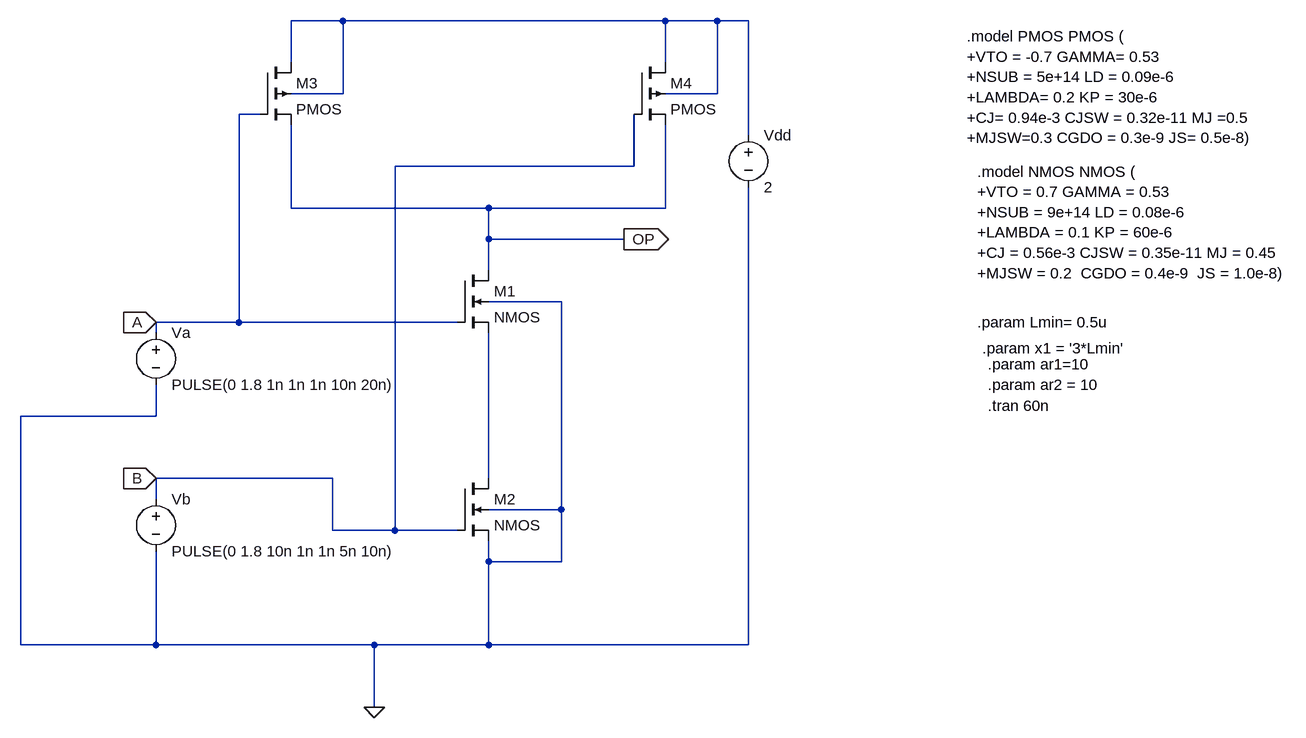
[diagram p0: schematic NAND.asc]
NAND.asc, the LTspice schematic file:
Version 4
SHEET 1 1508 836
WIRE -16 -240 -96 -240
WIRE 480 -240 -16 -240
WIRE 560 -240 480 -240
WIRE 608 -240 560 -240
WIRE -96 -176 -96 -240
WIRE 480 -176 480 -240
WIRE -16 -128 -16 -240
WIRE -16 -128 -96 -128
WIRE 560 -128 560 -240
WIRE 560 -128 480 -128
WIRE -144 -96 -176 -96
WIRE 608 -64 608 -240
WIRE 432 -16 432 -96
WIRE 432 -16 64 -16
WIRE -96 48 -96 -80
WIRE 208 48 -96 48
WIRE 480 48 480 -80
WIRE 480 48 208 48
WIRE 208 96 208 48
WIRE 416 96 208 96
WIRE 208 144 208 96
WIRE 320 192 208 192
WIRE -176 224 -176 -96
WIRE -176 224 -304 224
WIRE 160 224 -176 224
WIRE -304 240 -304 224
WIRE -304 368 -304 320
WIRE -304 368 -512 368
WIRE -32 464 -304 464
WIRE 208 464 208 240
WIRE -304 496 -304 464
WIRE 320 512 320 192
WIRE 320 512 208 512
WIRE -32 544 -32 464
WIRE 64 544 64 -16
WIRE 64 544 -32 544
WIRE 160 544 64 544
WIRE 208 592 208 560
WIRE 320 592 320 512
WIRE 320 592 208 592
WIRE -512 720 -512 368
WIRE -304 720 -304 576
WIRE -304 720 -512 720
WIRE 32 720 -304 720
WIRE 208 720 208 592
WIRE 208 720 32 720
WIRE 608 720 608 16
WIRE 608 720 208 720
WIRE 32 816 32 720
FLAG 416 96 OP
IOPIN 416 96 Out
FLAG -304 224 A
IOPIN -304 224 In
FLAG -304 464 B
IOPIN -304 464 In
FLAG 32 816 0
SYMBOL nmos4 160 144 R0
SYMATTR InstName M1
SYMATTR Value2 l={Lmin} w={AR1*Lmin} ad={x1*AR1*Lmin} as={x1*AR1*Lmin} pd={2*x1 + 2*AR1*Lmin} ps={2*x1 + 2*AR1*Lmin}
SYMBOL nmos4 160 464 R0
SYMATTR InstName M2
SYMATTR Value2 l={Lmin} w={AR1*Lmin} ad={x1*AR1*Lmin} as={x1*AR1*Lmin} pd={2*x1 + 2*AR1*Lmin} ps={2*x1 + 2*AR1*Lmin}
SYMBOL voltage -304 224 R0
WINDOW 123 0 0 Left 0
WINDOW 39 0 0 Left 0
SYMATTR InstName Va
SYMATTR Value PULSE(0 1.8 1n 1n 1n 10n 20n)
SYMBOL voltage -304 480 R0
WINDOW 123 0 0 Left 0
WINDOW 39 0 0 Left 0
SYMATTR InstName Vb
SYMATTR Value PULSE(0 1.8 10n 1n 1n 5n 10n)
SYMBOL pmos4 -144 -176 R0
SYMATTR InstName M3
SYMATTR Value2 l={Lmin} w={AR2*Lmin} ad={x1*AR2*Lmin} as={x1*AR2*Lmin} pd={2*x1 + 2*AR2*Lmin} ps={2*x1 + 2*AR2*Lmin}
SYMBOL pmos4 432 -176 R0
SYMATTR InstName M4
SYMATTR Value2 l={Lmin} w={AR2*Lmin} ad={x1*AR2*Lmin} as={x1*AR2*Lmin} pd={2*x1 + 2*AR2*Lmin} ps={2*x1 + 2*AR2*Lmin}
SYMBOL voltage 608 -80 R0
WINDOW 123 0 0 Left 0
WINDOW 39 0 0 Left 0
SYMATTR InstName Vdd
SYMATTR Value 2
TEXT 944 -216 Left 2 !.model PMOS PMOS (\n+VTO = -0.7 GAMMA= 0.53 \n+NSUB = 5e+14 LD = 0.09e-6 \n+LAMBDA= 0.2 KP = 30e-6\n+CJ= 0.94e-3 CJSW = 0.32e-11 MJ =0.5 \n+MJSW=0.3 CGDO = 0.3e-9 JS= 0.5e-8)
TEXT 960 -8 Left 2 !.model NMOS NMOS ( \n+VTO = 0.7 GAMMA = 0.53 \n+NSUB = 9e+14 LD = 0.08e-6 \n+LAMBDA = 0.1 KP = 60e-6 \n+CJ = 0.56e-3 CJSW = 0.35e-11 MJ = 0.45 \n+MJSW = 0.2  CGDO = 0.4e-9  JS = 1.0e-8)
TEXT 960 224 Left 2 !.param Lmin= 0.5u
TEXT 968 264 Left 2 !.param x1 = '3*Lmin'
TEXT 976 288 Left 2 !.param ar1=10
TEXT 976 320 Left 2 !.param ar2 = 10
TEXT 976 352 Left 2 !.tran 60n

The netlist it stands for:
* NAND.asc
M1 OP A N002 0 NMOS l={Lmin} w={AR1*Lmin} ad={x1*AR1*Lmin} as={x1*AR1*Lmin} pd={2*x1 + 2*AR1*Lmin} ps={2*x1 + 2*AR1*Lmin}
M2 N002 B 0 0 NMOS l={Lmin} w={AR1*Lmin} ad={x1*AR1*Lmin} as={x1*AR1*Lmin} pd={2*x1 + 2*AR1*Lmin} ps={2*x1 + 2*AR1*Lmin}
Va A 0 PULSE(0 1.8 1n 1n 1n 10n 20n)
Vb B 0 PULSE(0 1.8 10n 1n 1n 5n 10n)
M3 N001 A OP N001 PMOS l={Lmin} w={AR2*Lmin} ad={x1*AR2*Lmin} as={x1*AR2*Lmin} pd={2*x1 + 2*AR2*Lmin} ps={2*x1 + 2*AR2*Lmin}
M4 N001 B OP N001 PMOS l={Lmin} w={AR2*Lmin} ad={x1*AR2*Lmin} as={x1*AR2*Lmin} pd={2*x1 + 2*AR2*Lmin} ps={2*x1 + 2*AR2*Lmin}
Vdd N001 0 2
.model NMOS NMOS
.model PMOS PMOS
.lib standard.mos
.model PMOS PMOS (
+VTO = -0.7 GAMMA= 0.53
+NSUB = 5e+14 LD = 0.09e-6
+LAMBDA= 0.2 KP = 30e-6
+CJ= 0.94e-3 CJSW = 0.32e-11 MJ =0.5
+MJSW=0.3 CGDO = 0.3e-9 JS= 0.5e-8)
.model NMOS NMOS (
+VTO = 0.7 GAMMA = 0.53
+NSUB = 9e+14 LD = 0.08e-6
+LAMBDA = 0.1 KP = 60e-6
+CJ = 0.56e-3 CJSW = 0.35e-11 MJ = 0.45
+MJSW = 0.2  CGDO = 0.4e-9  JS = 1.0e-8)
.param Lmin= 0.5u
.param x1 = '3*Lmin'
.param ar1=10
.param ar2 = 10
.tran 60n
.backanno
.end